# EasyEDA schematic ESPMINERS.json
TITLE: DUINOCOIN MINER 12x; REV: 1.0; Date: 2021-10-13; Sheet: 1/1; Company: Your Company
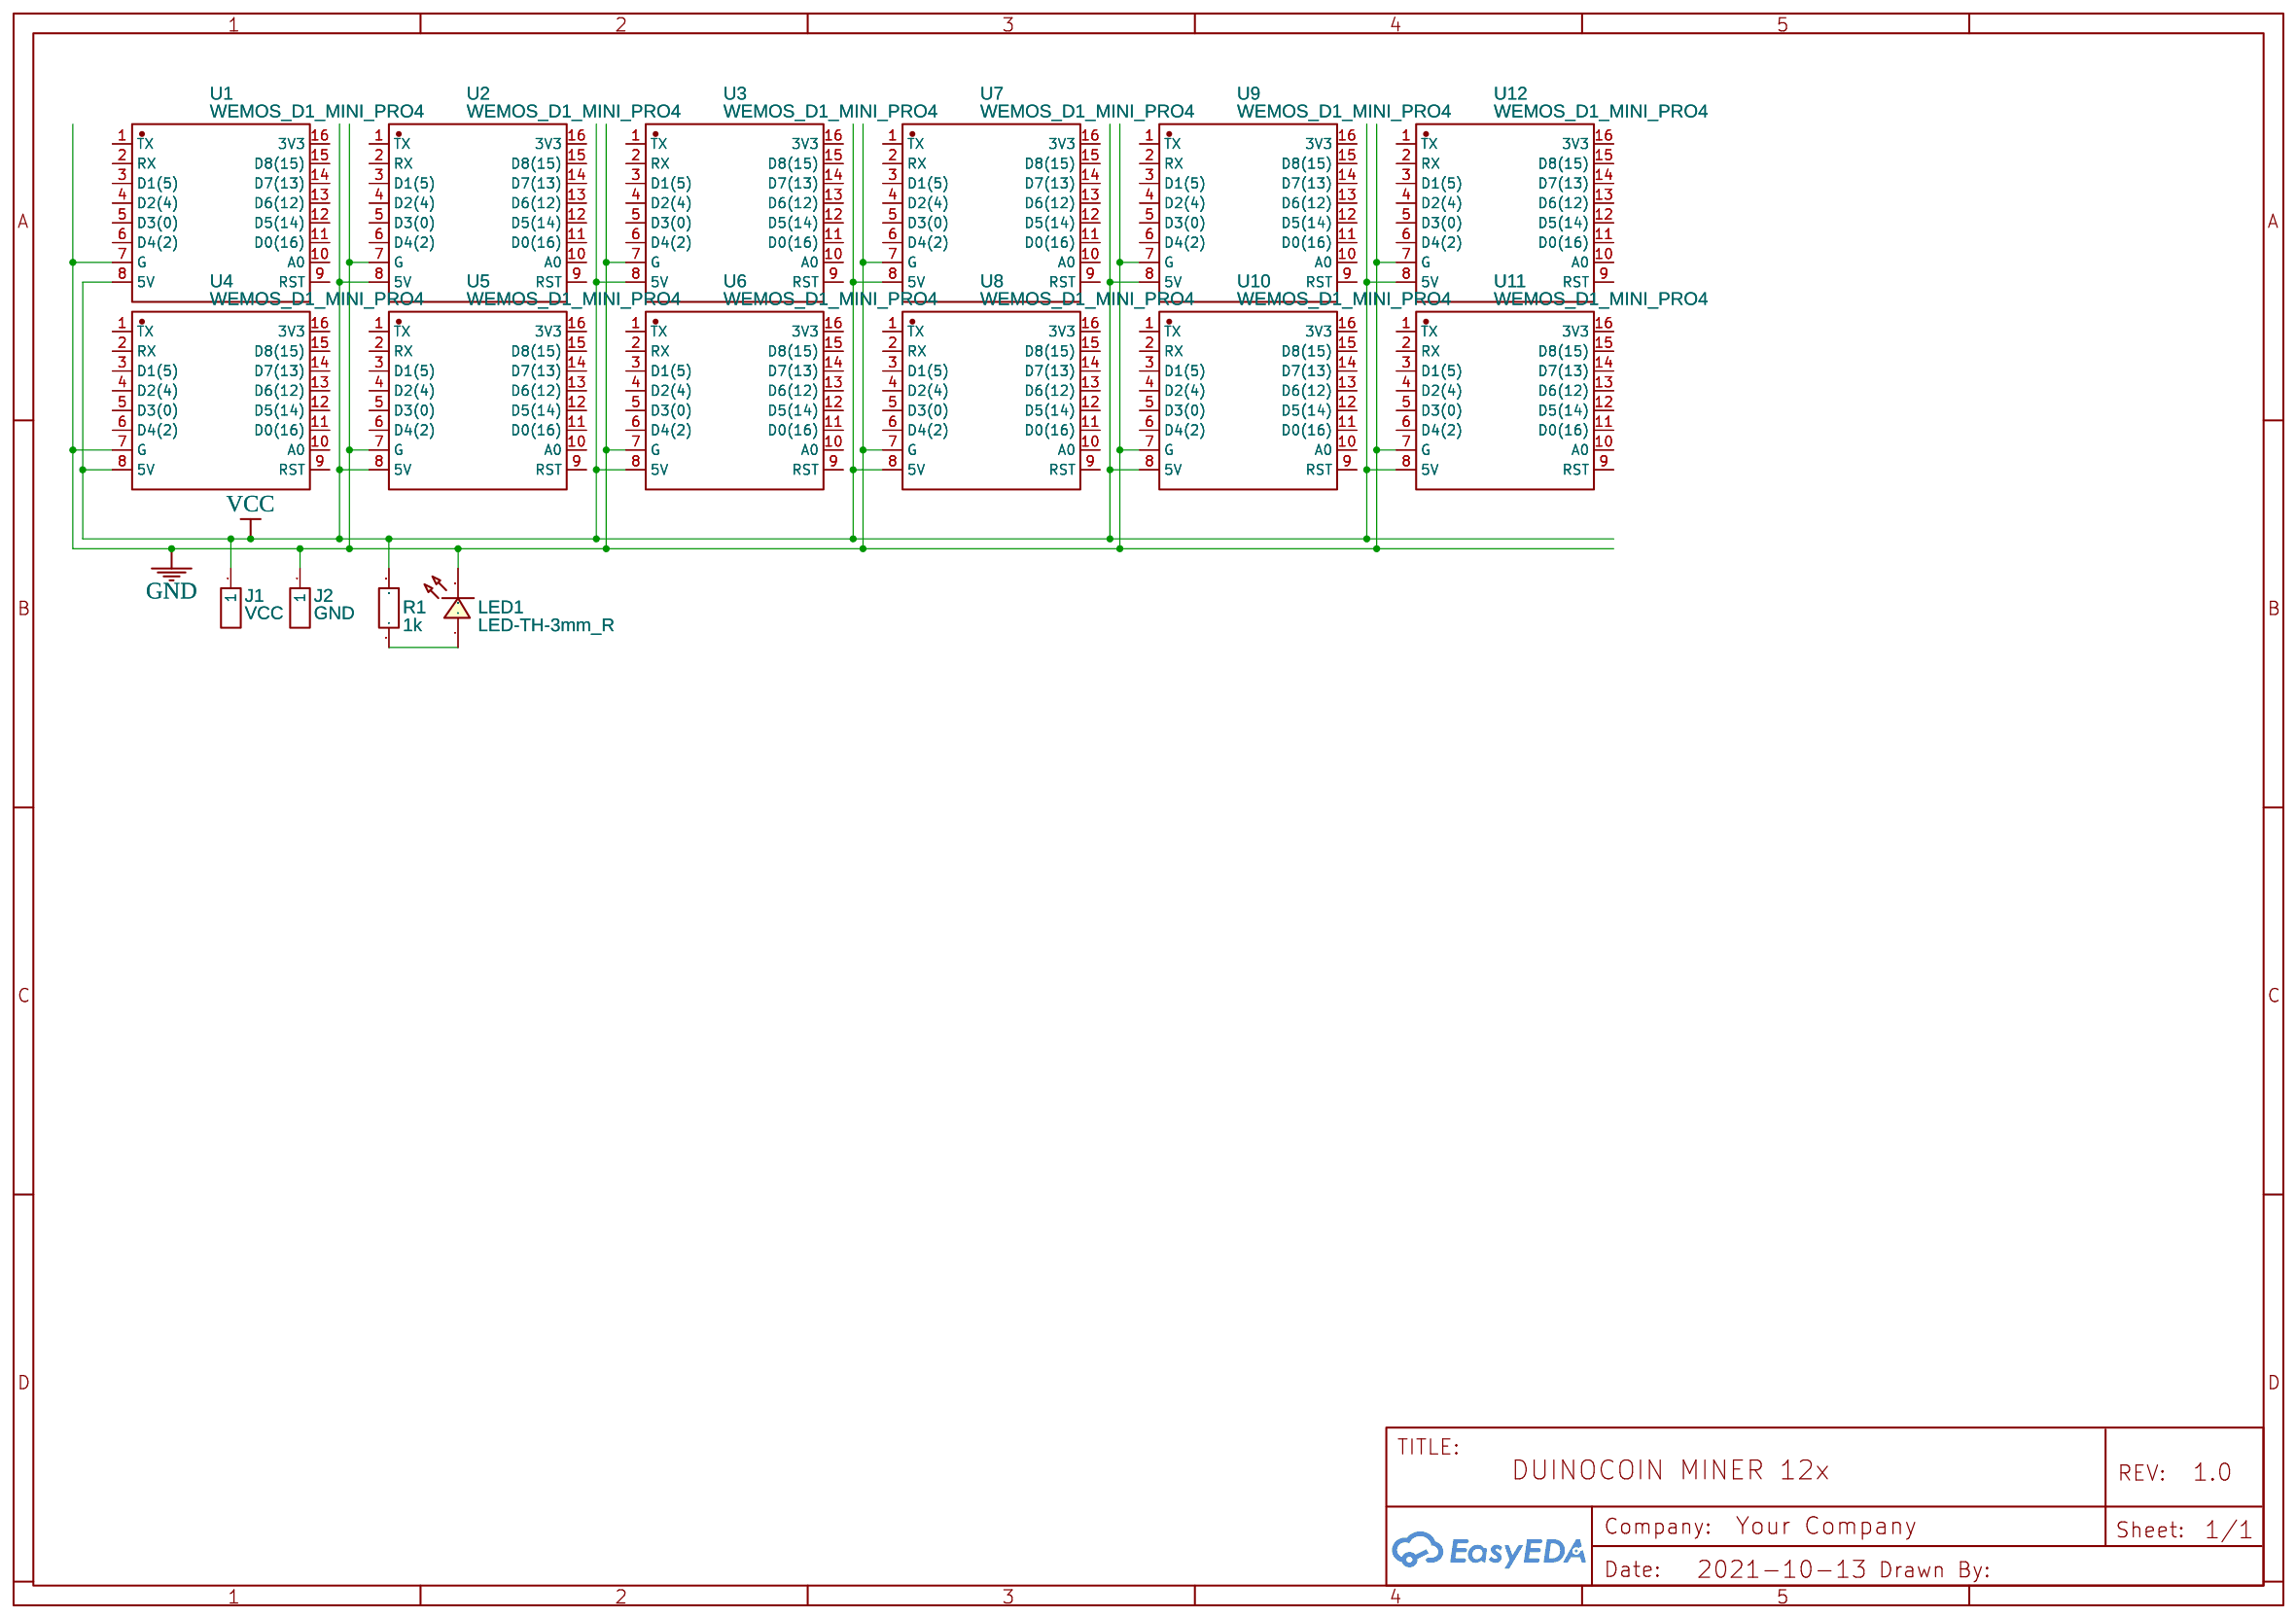
[diagram p0: schematic sheet]

## Parts
J1  VCC  [HDR-M-2.54_1X1]
J2  GND  [HDR-M-2.54_1X1]
LED1  LED-TH-3mm_R  [LED-TH_BD3.0_RED]
R1  1k  [R_AXIAL-0.3]
U1  WEMOS_D1_MINI_PRO4  [DIP-16_WEMOS_D1_MINI_PRO4]
U2  WEMOS_D1_MINI_PRO4  [DIP-16_WEMOS_D1_MINI_PRO4]
U3  WEMOS_D1_MINI_PRO4  [DIP-16_WEMOS_D1_MINI_PRO4]
U4  WEMOS_D1_MINI_PRO4  [DIP-16_WEMOS_D1_MINI_PRO4]
U5  WEMOS_D1_MINI_PRO4  [DIP-16_WEMOS_D1_MINI_PRO4]
U6  WEMOS_D1_MINI_PRO4  [DIP-16_WEMOS_D1_MINI_PRO4]
U7  WEMOS_D1_MINI_PRO4  [DIP-16_WEMOS_D1_MINI_PRO4]
U8  WEMOS_D1_MINI_PRO4  [DIP-16_WEMOS_D1_MINI_PRO4]
U9  WEMOS_D1_MINI_PRO4  [DIP-16_WEMOS_D1_MINI_PRO4]
U10  WEMOS_D1_MINI_PRO4  [DIP-16_WEMOS_D1_MINI_PRO4]
U11  WEMOS_D1_MINI_PRO4  [DIP-16_WEMOS_D1_MINI_PRO4]
U12  WEMOS_D1_MINI_PRO4  [DIP-16_WEMOS_D1_MINI_PRO4]

## Library data of the parts
J1 J2 = HDR-M-2.54_1x1: Supplier Part: C81276; Supplier: LCSC; Contributor: LCEDA_Lib
LED1 = LED-TH-3mm_R: Manufacturer: EVERLIGHT(台湾亿光); Manufacturer Part: 204-10SDRD/S530-A3-L; Supplier Part: C84774; Supplier: LCSC; Contributor: LCEDA_Lib
R1 = R_AXIAL-0.3_EU: Contributor: LCEDA_Lib
U1-U12 = WEMOS_D1_MINI_PRO4: Supplier: LCSC; Supplier Part: C2837266; Manufacturer: null; Manufacturer Part: Wemos_D1_mini_Pro4; Contributor: LCSC; JLCPCB Part Class: Extended Part

## Nets
GND: J2.1 LED1.2 U1.7(G) U2.7(G) U3.7(G) U4.7(G) U5.7(G) U6.7(G) U7.7(G) U8.7(G) U9.7(G) U10.7(G) U11.7(G) U12.7(G)
VCC: J1.1 R1.2 U1.8(5V) U2.8(5V) U3.8(5V) U4.8(5V) U5.8(5V) U6.8(5V) U7.8(5V) U8.8(5V) U9.8(5V) U10.8(5V) U11.8(5V) U12.8(5V)
Net-(LED1-1): LED1.1 R1.1

Not connected (* = marked no-connect by the designer): U1 1(TX) 2(RX) 3(D1(5)) 4(D2(4)) 5(D3(0)) 6(D4(2)) 9(RST) 10(A0) 11(D0(16)) 12(D5(14)) 13(D6(12)) 14(D7(13)) 15(D8(15)) 16(3V3); U2 1(TX) 2(RX) 3(D1(5)) 4(D2(4)) 5(D3(0)) 6(D4(2)) 9(RST) 10(A0) 11(D0(16)) 12(D5(14)) 13(D6(12)) 14(D7(13)) 15(D8(15)) 16(3V3); U3 1(TX) 2(RX) 3(D1(5)) 4(D2(4)) 5(D3(0)) 6(D4(2)) 9(RST) 10(A0) 11(D0(16)) 12(D5(14)) 13(D6(12)) 14(D7(13)) 15(D8(15)) 16(3V3); U4 1(TX) 2(RX) 3(D1(5)) 4(D2(4)) 5(D3(0)) 6(D4(2)) 9(RST) 10(A0) 11(D0(16)) 12(D5(14)) 13(D6(12)) 14(D7(13)) 15(D8(15)) 16(3V3); U5 1(TX) 2(RX) 3(D1(5)) 4(D2(4)) 5(D3(0)) 6(D4(2)) 9(RST) 10(A0) 11(D0(16)) 12(D5(14)) 13(D6(12)) 14(D7(13)) 15(D8(15)) 16(3V3); U6 1(TX) 2(RX) 3(D1(5)) 4(D2(4)) 5(D3(0)) 6(D4(2)) 9(RST) 10(A0) 11(D0(16)) 12(D5(14)) 13(D6(12)) 14(D7(13)) 15(D8(15)) 16(3V3); U7 1(TX) 2(RX) 3(D1(5)) 4(D2(4)) 5(D3(0)) 6(D4(2)) 9(RST) 10(A0) 11(D0(16)) 12(D5(14)) 13(D6(12)) 14(D7(13)) 15(D8(15)) 16(3V3); U8 1(TX) 2(RX) 3(D1(5)) 4(D2(4)) 5(D3(0)) 6(D4(2)) 9(RST) 10(A0) 11(D0(16)) 12(D5(14)) 13(D6(12)) 14(D7(13)) 15(D8(15)) 16(3V3); U9 1(TX) 2(RX) 3(D1(5)) 4(D2(4)) 5(D3(0)) 6(D4(2)) 9(RST) 10(A0) 11(D0(16)) 12(D5(14)) 13(D6(12)) 14(D7(13)) 15(D8(15)) 16(3V3); U10 1(TX) 2(RX) 3(D1(5)) 4(D2(4)) 5(D3(0)) 6(D4(2)) 9(RST) 10(A0) 11(D0(16)) 12(D5(14)) 13(D6(12)) 14(D7(13)) 15(D8(15)) 16(3V3); U11 1(TX) 2(RX) 3(D1(5)) 4(D2(4)) 5(D3(0)) 6(D4(2)) 9(RST) 10(A0) 11(D0(16)) 12(D5(14)) 13(D6(12)) 14(D7(13)) 15(D8(15)) 16(3V3); U12 1(TX) 2(RX) 3(D1(5)) 4(D2(4)) 5(D3(0)) 6(D4(2)) 9(RST) 10(A0) 11(D0(16)) 12(D5(14)) 13(D6(12)) 14(D7(13)) 15(D8(15)) 16(3V3)
